# Altium schematic sheet Sockets.SchDoc
size A4
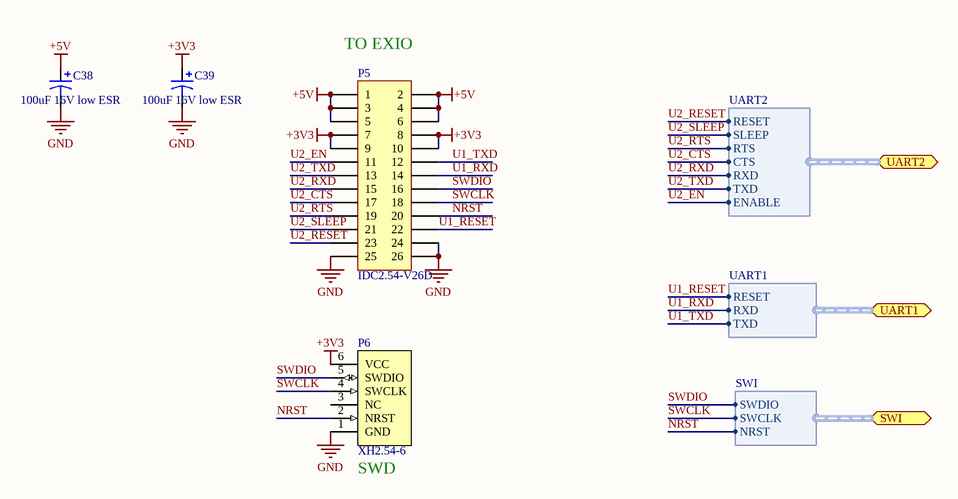
[diagram p0: Sockets.SchDoc]

## Parts
C38  100uF 16V low ESR  [CAPPR2-5x11]
C39  100uF 16V low ESR  [CAPPR2-5x11]
P5  IDC2.54-V26D  [IDC2.54-V26D]
P6  XH2.54-6  [REAL_SIP6_2.54]

## Ports
SWI (harness SWI), UART1 (harness UART1), UART2 (harness UART2)

## Harnesses
SWI: SWDIO, SWCLK, NRST
UART2: ENABLE, TXD, RXD, CTS, RTS, SLEEP, RESET
UART1: TXD, RXD, RESET

## Nets
+3V3: C39.1 P5.7 P5.8 P5.9 P5.10 P6.6(VCC)
+5V: C38.1 P5.1 P5.2 P5.3 P5.4 P5.5 P5.6
GND: C38.2 C39.2 P5.24 P5.25 P5.26 P6.1(GND)
NRST: P5.20 P6.2(NRST) ; port SWI.NRST
SWCLK: P5.18 P6.4(SWCLK) ; port SWI.SWCLK
SWDIO: P5.16 P6.5(SWDIO) ; port SWI.SWDIO
U1_RESET: P5.22 ; port UART1.RESET
U1_RXD: P5.14 ; port UART1.RXD
U1_TXD: P5.12 ; port UART1.TXD
U2_CTS: P5.17 ; port UART2.CTS
U2_EN: P5.11 ; port UART2.ENABLE
U2_RESET: P5.23 ; port UART2.RESET
U2_RTS: P5.19 ; port UART2.RTS
U2_RXD: P5.15 ; port UART2.RXD
U2_SLEEP: P5.21 ; port UART2.SLEEP
U2_TXD: P5.13 ; port UART2.TXD

Not connected (* = marked no-connect by the designer): P6 3(NC)

## Notes on the sheet
- (near P5) TO EXIO
- (near P6) SWD

## Library data of the parts
C38 C39 = Cap Pol1: Polarized Capacitor (Radial); Price: 0.38
P5 = Header 13X2: IDC2.54-13x2 Header; LatestRevisionDate: 17-Jul-2002; LatestRevisionNote: Re-released for DXP Platform.; Publisher: Altium Limited; Price: 0.38
P6 = SWD-Connector: SW debug connector